# Altium schematic sheet GATEWAY.SchDoc
size A
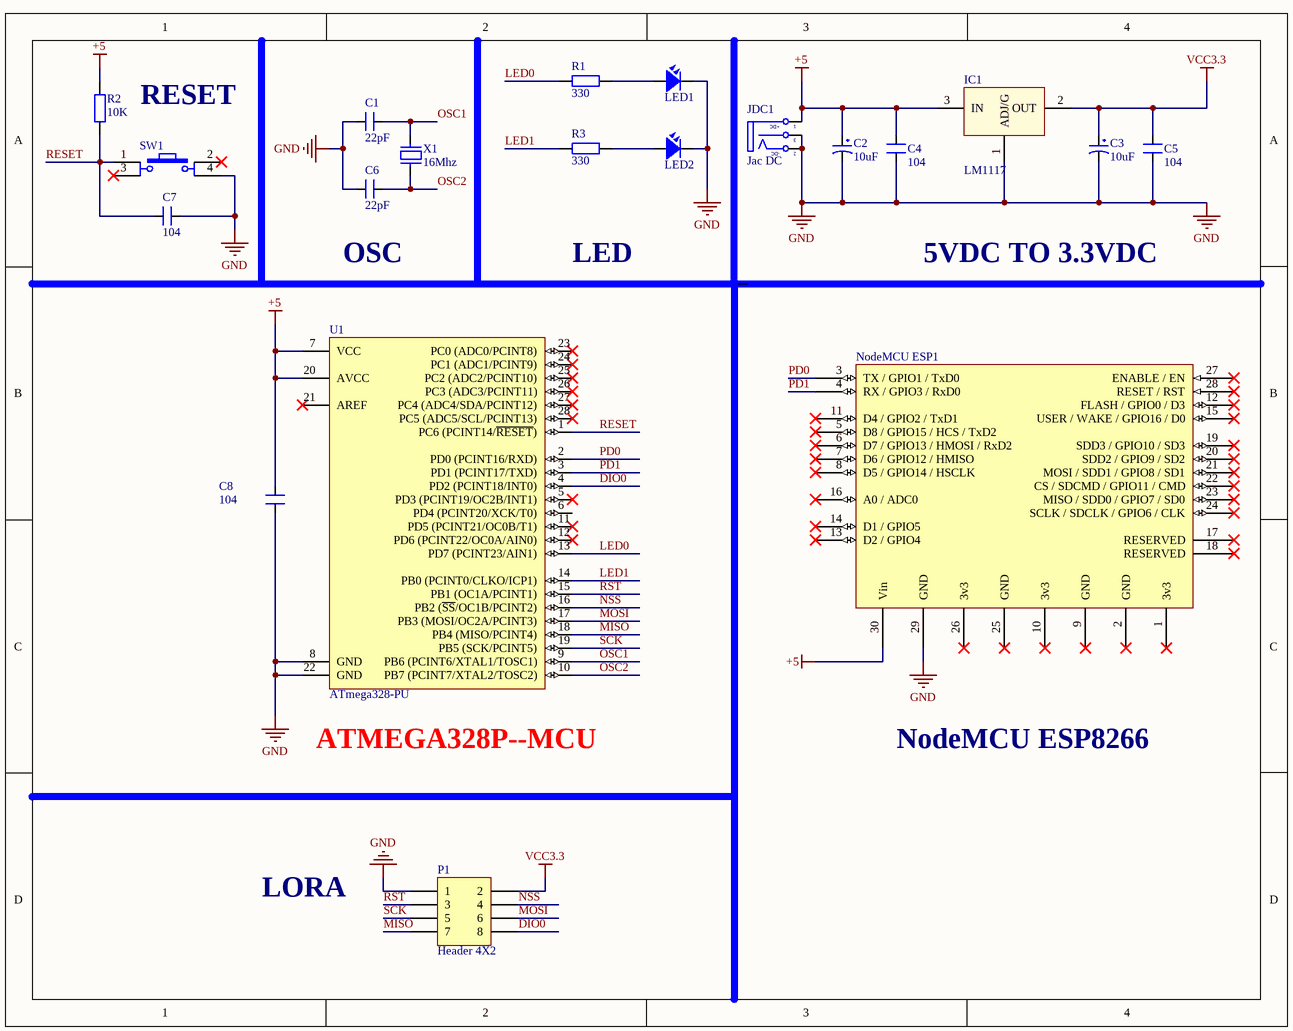
[diagram p0: GATEWAY.SchDoc]

## Parts
C1  22pF  [CN1]
C2  10uF  [CP1/2]
C3  10uF  [CP1/2]
C4  104  [CN2]
C5  104  [CN2]
C6  22pF  [CN1]
C7  104  [CN2]
C8  104  [CN2]
IC1  LM1117  [SOT223-4N]
JDC1  Jac DC  [DC0]
LED1  LED  [LED-5-Yellow]  (value not drawn)
LED2  LED  [LED-5-BLUE]  (value not drawn)
NodeMCU_ESP1  NodeMCU  [NodeMCU DevKit v1.0 - Inside Labels]  (value not drawn)
P1  Header 4X2  [HDR2X4]
R1  330  [R1/2W]
R2  10K  [R1/2W]
R3  330  [R1/2W]
SW1  SW  [SW4]  (value not drawn)
U1  ATmega328-PU  [DIP28]
X1  16Mhz  [XT2]

## Nets
+5: C2.1 C4.2 C8.2 IC1.3(IN) JDC1.1(T) NodeMCU_ESP1.30(Vin) R2.2 U1.7(VCC) U1.20(AVCC)
GND: C1.1 C2.2 C3.2 C4.1 C5.1 C6.1 C7.2 C8.1 IC1.1(ADJ/G) JDC1.2(TN) JDC1.3(S) LED1.2 LED2.2 NodeMCU_ESP1.29(GND) P1.1 SW1.4 U1.8(GND) U1.22(GND)
VCC3.3: C3.1 C5.2 IC1.2(OUT) P1.2
DIO0: P1.8 U1.4(PD2_(PCINT18/INT0))
LED0: R1.2 U1.13(PD7_(PCINT23/AIN1))
LED1: R3.2 U1.14(PB0_(PCINT0/CLKO/ICP1))
MISO: P1.7 U1.18(PB4_(MISO/PCINT4))
MOSI: P1.6 U1.17(PB3_(MOSI/OC2A/PCINT3))
NSS: P1.4 U1.16(PB2_(~{SS}/OC1B/PCINT2))
OSC1: C1.2 U1.9(PB6_(PCINT6/XTAL1/TOSC1)) X1.2
OSC2: C6.2 U1.10(PB7_(PCINT7/XTAL2/TOSC2)) X1.1
PD0: NodeMCU_ESP1.3(TX_/_GPIO1_/_TxD0) U1.2(PD0_(PCINT16/RXD))
PD1: NodeMCU_ESP1.4(RX_/_GPIO3_/_RxD0) U1.3(PD1_(PCINT17/TXD))
RESET: C7.1 R2.1 SW1.1 U1.1(PC6_(PCINT14/~{RESET}))
RST: P1.3 U1.15(PB1_(OC1A/PCINT1))
SCK: P1.5 U1.19(PB5_(SCK/PCINT5))
NetLED1_1: LED1.1 R1.1
NetLED2_1: LED2.1 R3.1

Not connected (* = marked no-connect by the designer): NodeMCU_ESP1 1(3v3)* 2(GND)* 5(D8_/_GPIO15_/_HCS_/_TxD2)* 6(D7_/_GPIO13_/_HMOSI_/_RxD2)* 7(D6_/_GPIO12_/_HMISO)* 8(D5_/_GPIO14_/_HSCLK)* 9(GND)* 10(3v3)* 11(D4_/_GPIO2_/_TxD1)* 12(FLASH_/_GPIO0_/_D3)* 13(D2_/_GPIO4)* 14(D1_/_GPIO5)* 15(USER_/_WAKE_/_GPIO16_/_D0)* 16(A0_/_ADC0)* 17(RESERVED)* 18(RESERVED)* 19(SDD3_/_GPIO10_/_SD3)* 20(SDD2_/_GPIO9_/_SD2)* 21(MOSI_/_SDD1_/_GPIO8_/_SD1)* 22(CS_/_SDCMD_/_GPIO11_/_CMD)* 23(MISO_/_SDD0_/_GPIO7_/_SD0)* 24(SCLK_/_SDCLK_/_GPIO6_/_CLK)* 25(GND)* 26(3v3)* 27(ENABLE_/_EN)* 28(RESET_/_RST)*; SW1 2* 3*; U1 5(PD3_(PCINT19/OC2B/INT1))* 6(PD4_(PCINT20/XCK/T0)) 11(PD5_(PCINT21/OC0B/T1))* 12(PD6_(PCINT22/OC0A/AIN0))* 21(AREF)* 23(PC0_(ADC0/PCINT8))* 24(PC1_(ADC1/PCINT9))* 25(PC2_(ADC2/PCINT10))* 26(PC3_(ADC3/PCINT11))* 27(PC4_(ADC4/SDA/PCINT12))* 28(PC5_(ADC5/SCL/PCINT13))*

## Notes on the sheet
- RESET
- (near C6) OSC
- LED
- 5VDC TO 3.3VDC
- (near U1) ATMEGA328P--MCU
- NodeMCU ESP8266
- LORA
- (in symbol DCIN) +DC; -DC

## Library data of the parts
C1 C6 = CN1: Cap np  1pF - 472pF; Value: 100pF
C2 C3 = CP1: Cap P  0,1uF < 22uF , 16 - 50V; Value: 10uF/50V; Description 1: 10 => 220uF/6,3V/10V - 10uF => 100uF/16V; Description 2: 0,1uF => 33uF/50V - 10uF => 22uF/63V; Description 3: 0,47uF => 10uF/100V
C4 C5 C7 C8 = CN2: Cap np 104 => 105pF; Value: 0.1uF
IC1 = LM1117: Available in 1.8V, 2.5V, 2.85V, 3.3V, 5V, and  Adjustable Versions; Value: LM317
JDC1 = DCIN: Jac DC input; Value: Jac DC
LED1 LED2 = LED: LED Single colour Green and Red; Value: LED 3 ly Single Colour
NodeMCU_ESP1 = NodeMCU DevKit v1.0
P1 = Header 4X2: Header, 4-Pin, Dual row; LatestRevisionDate: 17-Jul-2002; LatestRevisionNote: Re-released for DXP Platform.; Publisher: Altium Limited
R1-R3 = R1/4W: Resistor 1/4W; Value: R1/4W - 1K
SW1 = SW4: Switch button 4 pin; Value: Button chip 4 pin
U1 = ATmega328-PU: 8-bit AVR Microcontroller, 32KB Flash, 1KB EEPROM, 2KB SRAM, 28-pin PDIP, Industrial Grade (-40°C to 85°C); Published: 1-Apr-2010; DatasheetVersion: revA, Jan-2010; PackageVersion: revB, Sep-2001; PackageReference: 28P3; Publisher: Altium Limited; PackageDescription: 28-lead (0.300"/7.62mm Wide) Plastic Dual Inline Package (PDIP); Supplier 1: Digi-Key; Supplier Part Number 1: ATMEGA328-PU-ND; Supplier 2: Mouser; Supplier Part Number 2: 556-ATMEGA328-PU; ComponentLink1Description: Manufacturer Link; ComponentLink1URL: http://www.atmel.com/products/avr/default.asp?; ComponentLink2Description: ATmega48A/48PA/88A/88PA/168A/168PA/328/328P Datasheet; ComponentLink2URL: http://www.atmel.com/dyn/resources/prod_documents/8271.pdf; ComponentLink3Description: ATmega48A/48PA/88A/88PA/168A/168PA/328/328P Summary; ComponentLink3URL: http://www.atmel.com/dyn/resources/prod_documents/8271S.pdf; ComponentLink4Description: Atmel.com Home; ComponentLink4URL: http://www.atmel.com
X1 = XT2: Crystal For all Crystal 2pin.; Value: 4Mhz